# EAGLE design hw4 (EAGLE 9.6.2)
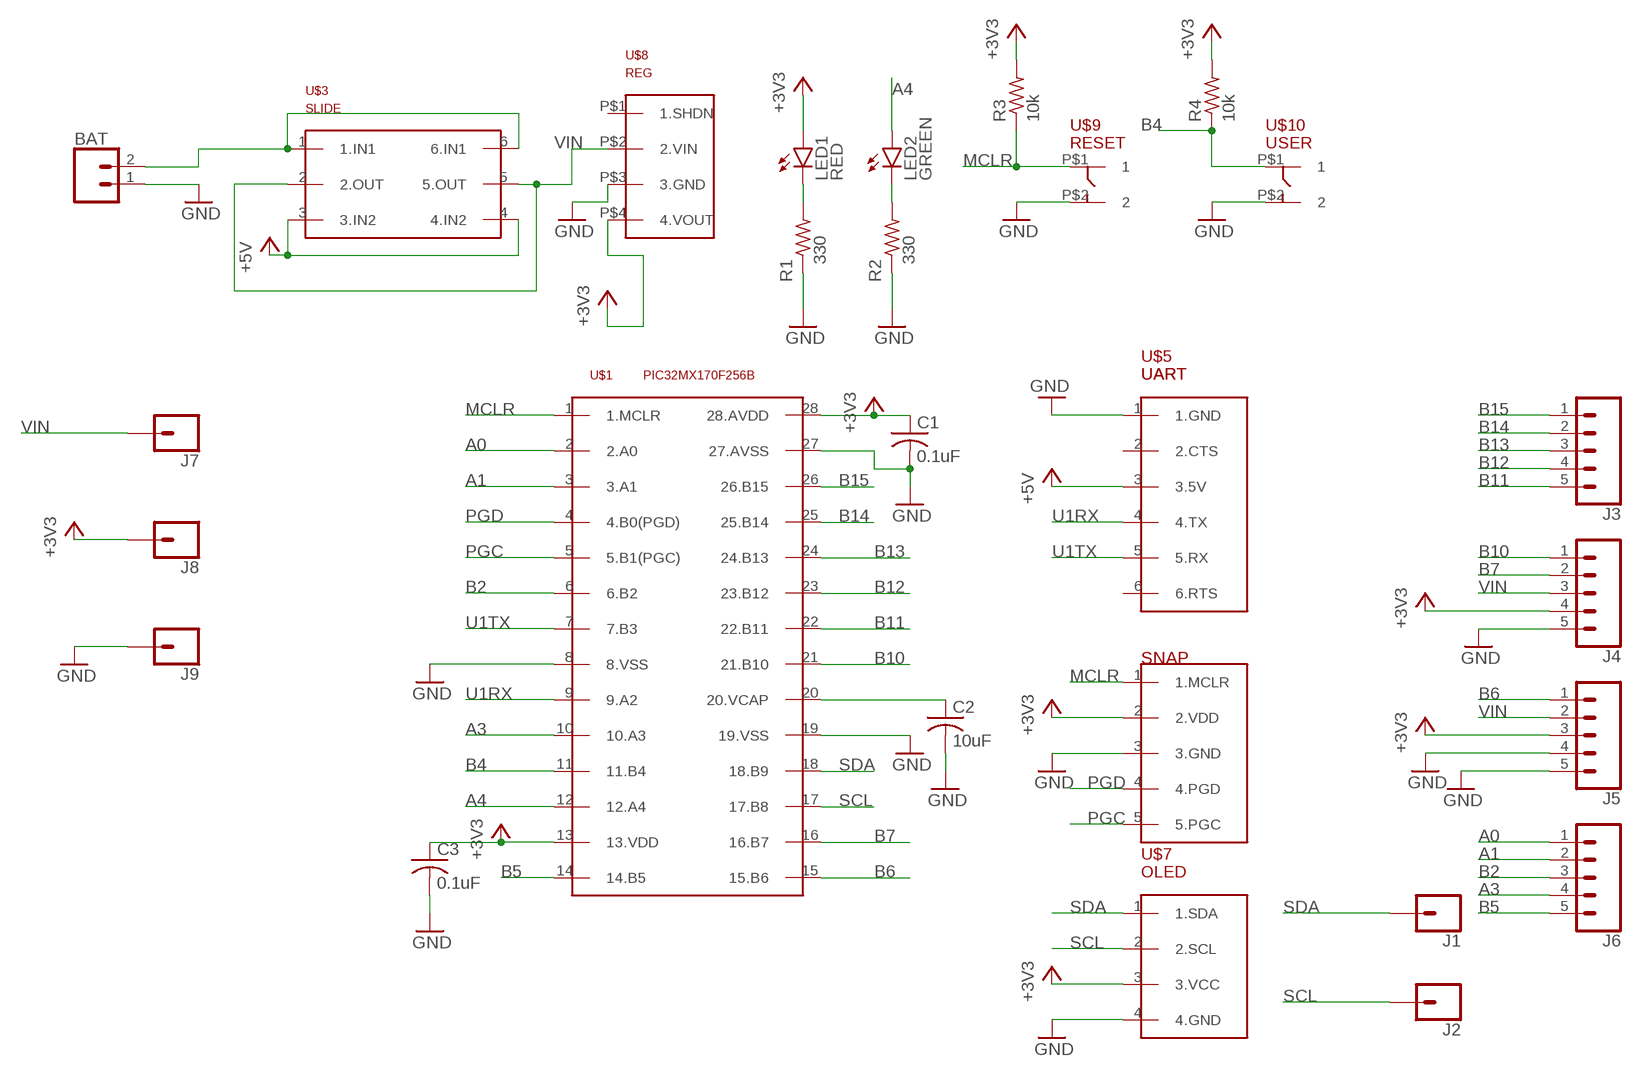
[diagram p0: schematic, sheet 1]

## Parts
BAT  CONN_02  [1X02]
C1  0.1uF  C-US025-024X044  [C025-024X044]
C2  10uF  C-US025-024X044  [C025-024X044]
C3  0.1uF  C-US025-024X044  [C025-024X044]
J1  CONN_01  [1X01]
J2  CONN_01  [1X01]
J3  CONN_05  [1X05]
J4  CONN_05  [1X05]
J5  CONN_05  [1X05]
J6  CONN_05  [1X05]
J7  CONN_01  [1X01]
J8  CONN_01  [1X01]
J9  CONN_01  [1X01]
LED1  RED  LED3MM  [LED3MM]
LED2  GREEN  LED3MM  [LED3MM]
R1  330  R-US_0207/7  [0207/7]
R2  330  R-US_0207/7  [0207/7]
R3  10k  R-US_0207/2V  [0207/2V]
R4  10k  R-US_0207/2V  [0207/2V]
U$1  PIC32MX170F256B  [DIL28-3]
U$3  SLIDE  [SLIDE]
U$5  UART  [UART]
U$6  SNAP  [SNAP]
U$7  OLED  [OLED]
U$8  REG  [REG]
U$9  RESET  PUSH  [PUSH]
U$10  USER  PUSH  [PUSH]

## Nets
+3V3: C1.1 C3.1 J4.4 J5.3 J8.1 LED1.A R3.2 R4.2 U$1.13(13.VDD) U$1.28(28.AVDD) U$6.2(2.VDD) U$7.3(3.VCC) U$8.P$4(4.VOUT)
+5V: U$3.3(3.IN2) U$3.4(4.IN2) U$5.3(3.5V)
A0: J6.1 U$1.2(2.A0)
A1: J6.2 U$1.3(3.A1)
A3: J6.4 U$1.10(10.A3)
A4: LED2.A U$1.12(12.A4)
B2: J6.3 U$1.6(6.B2)
B4: R4.1 U$1.11(11.B4) U$10.P$1
B5: J6.5 U$1.14(14.B5)
B6: J5.1 U$1.15(15.B6)
B7: J4.2 U$1.16(16.B7)
B10: J4.1 U$1.21(21.B10)
B11: J3.5 U$1.22(22.B11)
B12: J3.4 U$1.23(23.B12)
B13: J3.3 U$1.24(24.B13)
B14: J3.2 U$1.25(25.B14)
B15: J3.1 U$1.26(26.B15)
GND: BAT.1 C1.2 C2.2 C3.2 J4.5 J5.4 J5.5 J9.1 R1.1 R2.1 U$1.8(8.VSS) U$1.19(19.VSS) U$1.27(27.AVSS) U$5.1(1.GND) U$6.3(3.GND) U$7.4(4.GND) U$8.P$3(3.GND) U$9.P$2 U$10.P$2
MCLR: R3.1 U$1.1(1.MCLR) U$6.1(1.MCLR) U$9.P$1
N$1: BAT.2 U$3.1(1.IN1) U$3.6(6.IN1)
N$4: C2.1 U$1.20(20.VCAP)
N$5: LED1.K(C) R1.2
N$6: LED2.K(C) R2.2
PGC: U$1.5(5.B1(PGC)) U$6.5(5.PGC)
PGD: U$1.4(4.B0(PGD)) U$6.4(4.PGD)
SCL: J2.1 U$1.17(17.B8) U$7.2(2.SCL)
SDA: J1.1 U$1.18(18.B9) U$7.1(1.SDA)
U1RX: U$1.9(9.A2) U$5.4(4.TX)
U1TX: U$1.7(7.B3) U$5.5(5.RX)
VIN: J4.3 J5.2 J7.1 U$3.2(2.OUT) U$3.5(5.OUT) U$8.P$2(2.VIN)
Unconnected: U$5.2(2.CTS) U$5.6(6.RTS) U$8.P$1(1.SHDN)

## Notes on the sheet
- SNAP

## Library data of the parts
BAT = hw4:CONN_02: Multi connection point. Often used as Generic Header-pin footprint for 0.1 inch spaced/style header connections On any of the 0.1 inch spaced packages, you can populate with these: Break Away Headers - Straight <https://www.sparkfun.com/products/116> (PRT-00116) Break Away Male Headers - Right Angle <https://www.sparkfun.com/products/553> (PRT-00553) Female Headers <https://www.sparkfun.com/products/115> (PRT-00115) Break Away Headers - Machine Pin <https://www.sparkfun.com/products/117> (PRT-00117) Break Away Female Headers - Swiss Machine Pin <https://www.sparkfun.com/products/743> (PRT-00743) For SCREWTERMINALS and SPRING TERMINALS visit here: Screw Terimnals on SparkFun.com <https://www.sparkfun.com/search/results?term=Screw+Terminals> (5mm/3.5mm/2.54mm spacing) This device is also useful as a general connection point to wire up your design to another part of your project. Our various solder wires solder well into these plated through hole pads. Hook-Up Wire - Assortment (Stranded, 22 AWG) <https://www.sparkfun.com/products/11375> (PRT-11375) Hook-Up Wire - Assortment (Solid Core, 22 AWG) <https://www.sparkfun.com/products/11367> (PRT-11367) View the entire wire category on our website here <https://www.sparkfun.com/categories/141> Special notes: Molex polarized connector foot print use with: PRT-08233 with associated crimp pins and housings. 2.54_SCREWTERM for use with PRT-10571. 3.5mm Screw Terminal footprints for PRT-08084 5mm Screw Terminal footprints for use with PRT-08432
C1-C3 = hw4:C-US: CAPACITOR, American symbol; SPICEPREFIX: C
J1 J2 J7-J9 = SparkFun-Connectors:CONN_01: Single connection point. Often used as Generic Header-pin footprint for 0.1 inch spaced/style header connections On any of the 0.1 inch spaced packages, you can populate with these: Break Away Headers - Straight <https://www.sparkfun.com/products/116> (PRT-00116) Break Away Male Headers - Right Angle <https://www.sparkfun.com/products/553> (PRT-00553) Female Headers <https://www.sparkfun.com/products/115> (PRT-00115) Break Away Headers - Machine Pin <https://www.sparkfun.com/products/117> (PRT-00117) Break Away Female Headers - Swiss Machine Pin <https://www.sparkfun.com/products/743> (PRT-00743) This device is also useful as a general connection point to wire up your design to another part of your project. Our various solder wires solder well into these plated through hole pads. Hook-Up Wire - Assortment (Stranded, 22 AWG) <https://www.sparkfun.com/products/11375> (PRT-11375) Hook-Up Wire - Assortment (Solid Core, 22 AWG) <https://www.sparkfun.com/products/11367> (PRT-11367) View the entire wire category on our website here <https://www.sparkfun.com/categories/141> Special notes: SMTSO-256-ET is a "flush mount" nut for a 4-40 screw. We mostly use this on specialty testbeds; it is a nice way to connect hardware to your PCB at an adjustable hieght. Also note, the SNAP packages are for using a snappable style connector. We sell a baggie of snaps and they are also used on two LilyPad designs: Snap Assortment - 30 pack (male and female) <https://www.sparkfun.com/products/11347> (DEV-11347) LilyPad Arduino SimpleSnap <https://www.sparkfun.com/products/10941> (DEV-10941) LilyPad SimpleSnap Protoboard <https://www.sparkfun.com/products/10940> (DEV-10940)
J3-J6 = hw4:CONN_05: Multi connection point. Often used as Generic Header-pin footprint for 0.1 inch spaced/style header connections On any of the 0.1 inch spaced packages, you can populate with these: Break Away Headers - Straight <https://www.sparkfun.com/products/116> (PRT-00116) Break Away Male Headers - Right Angle <https://www.sparkfun.com/products/553> (PRT-00553) Female Headers <https://www.sparkfun.com/products/115> (PRT-00115) Break Away Headers - Machine Pin <https://www.sparkfun.com/products/117> (PRT-00117) Break Away Female Headers - Swiss Machine Pin <https://www.sparkfun.com/products/743> (PRT-00743) For SCREWTERMINALS and SPRING TERMINALS visit here: Screw Terimnals on SparkFun.com <https://www.sparkfun.com/search/results?term=Screw+Terminals> (5mm/3.5mm/2.54mm spacing) This device is also useful as a general connection point to wire up your design to another part of your project. Our various solder wires solder well into these plated through hole pads. Hook-Up Wire - Assortment (Stranded, 22 AWG) <https://www.sparkfun.com/products/11375> (PRT-11375) Hook-Up Wire - Assortment (Solid Core, 22 AWG) <https://www.sparkfun.com/products/11367> (PRT-11367) View the entire wire category on our website here <https://www.sparkfun.com/categories/141> Special notes: Molex polarized connector foot print use with SKU : PRT-08231 with associated crimp pins and housings. 1MM SMD Version SKU: PRT-10208
LED1 LED2 = hw4:LED: LED OSRAM: - CHIPLED LG R971, LG N971, LY N971, LG Q971, LY Q971, LO R971, LY R971 LH N974, LH R974 LS Q976, LO Q976, LY Q976 LO Q996 - Hyper CHIPLED LW Q18S LB Q993, LB Q99A, LB R99A - SideLED LS A670, LO A670, LY A670, LG A670, LP A670 LB A673, LV A673, LT A673, LW A673 LH A674 LY A675 LS A676, LA A676, LO A676, LY A676, LW A676 LS A679, LY A679, LG A679 - Hyper Micro SIDELED® LS Y876, LA Y876, LO Y876, LY Y876 LT Y87S - SmartLED LW L88C, LW L88S LB L89C, LB L89S, LG L890 LS L89K, LO L89K, LY L89K LS L896, LA L896, LO L896, LY L896 - TOPLED LS T670, LO T670, LY T670, LG T670, LP T670 LSG T670, LSP T670, LSY T670, LOP T670, LYG T670 LG T671, LOG T671, LSG T671 LB T673, LV T673, LT T673, LW T673 LH T674 LS T676, LA T676, LO T676, LY T676, LB T676, LH T676, LSB T676, LW T676 LB T67C, LV T67C, LT T67C, LS T67K, LO T67K, LY T67K, LW E67C LS E67B, LA E67B, LO E67B, LY E67B, LB E67C, LV E67C, LT E67C LW T67C LS T679, LY T679, LG T679 LS T770, LO T770, LY T770, LG T770, LP T770 LB T773, LV T773, LT T773, LW T773 LH T774 LS E675, LA E675, LY E675, LS T675 LS T776, LA T776, LO T776, LY T776, LB T776 LHGB T686 LT T68C, LB T68C - Hyper Mini TOPLED® LB M676 - Mini TOPLED Santana® LG M470 LS M47K, LO M47K, LY M47K Source: http://www.osram.convergy.de LUXEON: - LUMILED® LXK2-PW12-R00, LXK2-PW12-S00, LXK2-PW14-U00, LXK2-PW14-V00 LXK2-PM12-R00, LXK2-PM12-S00, LXK2-PM14-U00 LXK2-PE12-Q00, LXK2-PE12-R00, LXK2-PE12-S00, LXK2-PE14-T00, LXK2-PE14-U00 LXK2-PB12-K00, LXK2-PB12-L00, LXK2-PB12-M00, LXK2-PB14-N00, LXK2-PB14-P00, LXK2-PB14-Q00 LXK2-PR12-L00, LXK2-PR12-M00, LXK2-PR14-Q00, LXK2-PR14-R00 LXK2-PD12-Q00, LXK2-PD12-R00, LXK2-PD12-S00 LXK2-PH12-R00, LXK2-PH12-S00 LXK2-PL12-P00, LXK2-PL12-Q00, LXK2-PL12-R00 Source: www.luxeon.com KINGBRIGHT: KA-3528ASYC Source: www.kingbright.com
R1-R4 = hw4:R-US_: RESISTOR, American symbol; SPICEPREFIX: R
U$1 = hw4:PIC32MX170F256B
U$3 = hw4:SLIDE
U$5 = hw4:UART
U$6 = hw4:SNAP
U$7 = hw4:OLED
U$8 = hw4:REG
U$9 U$10 = hw4:PUSH

## Board
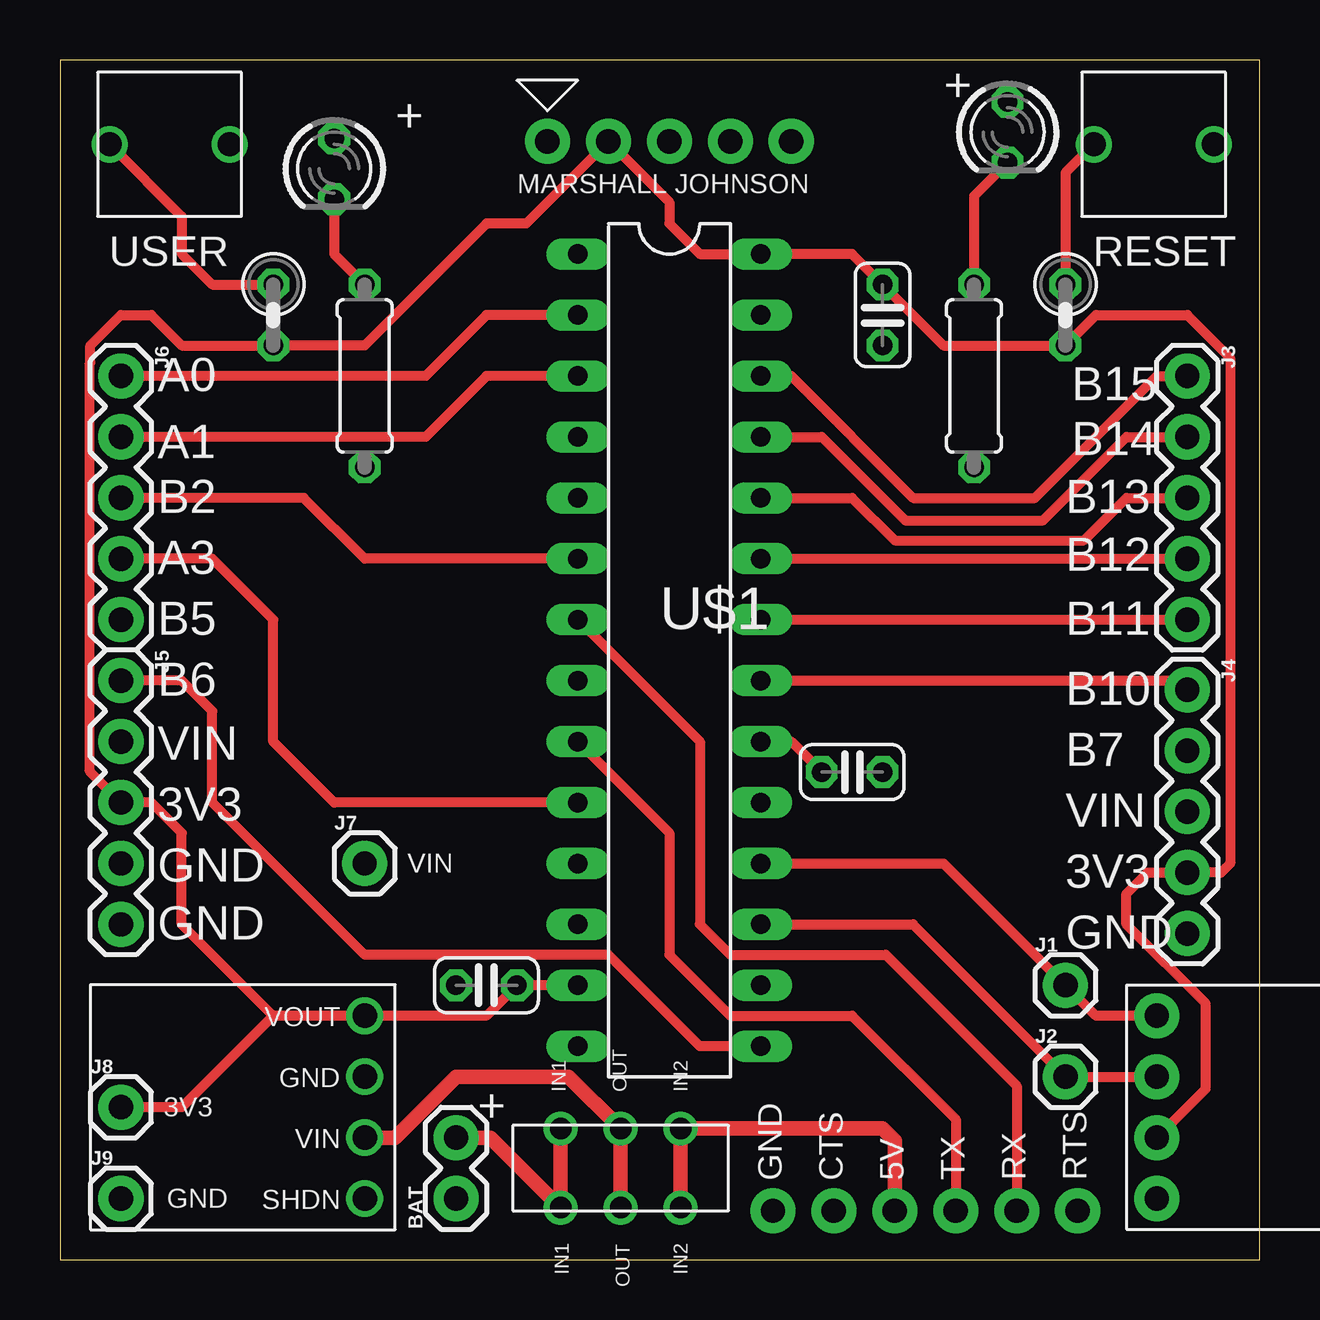
[diagram p1: board, top side]
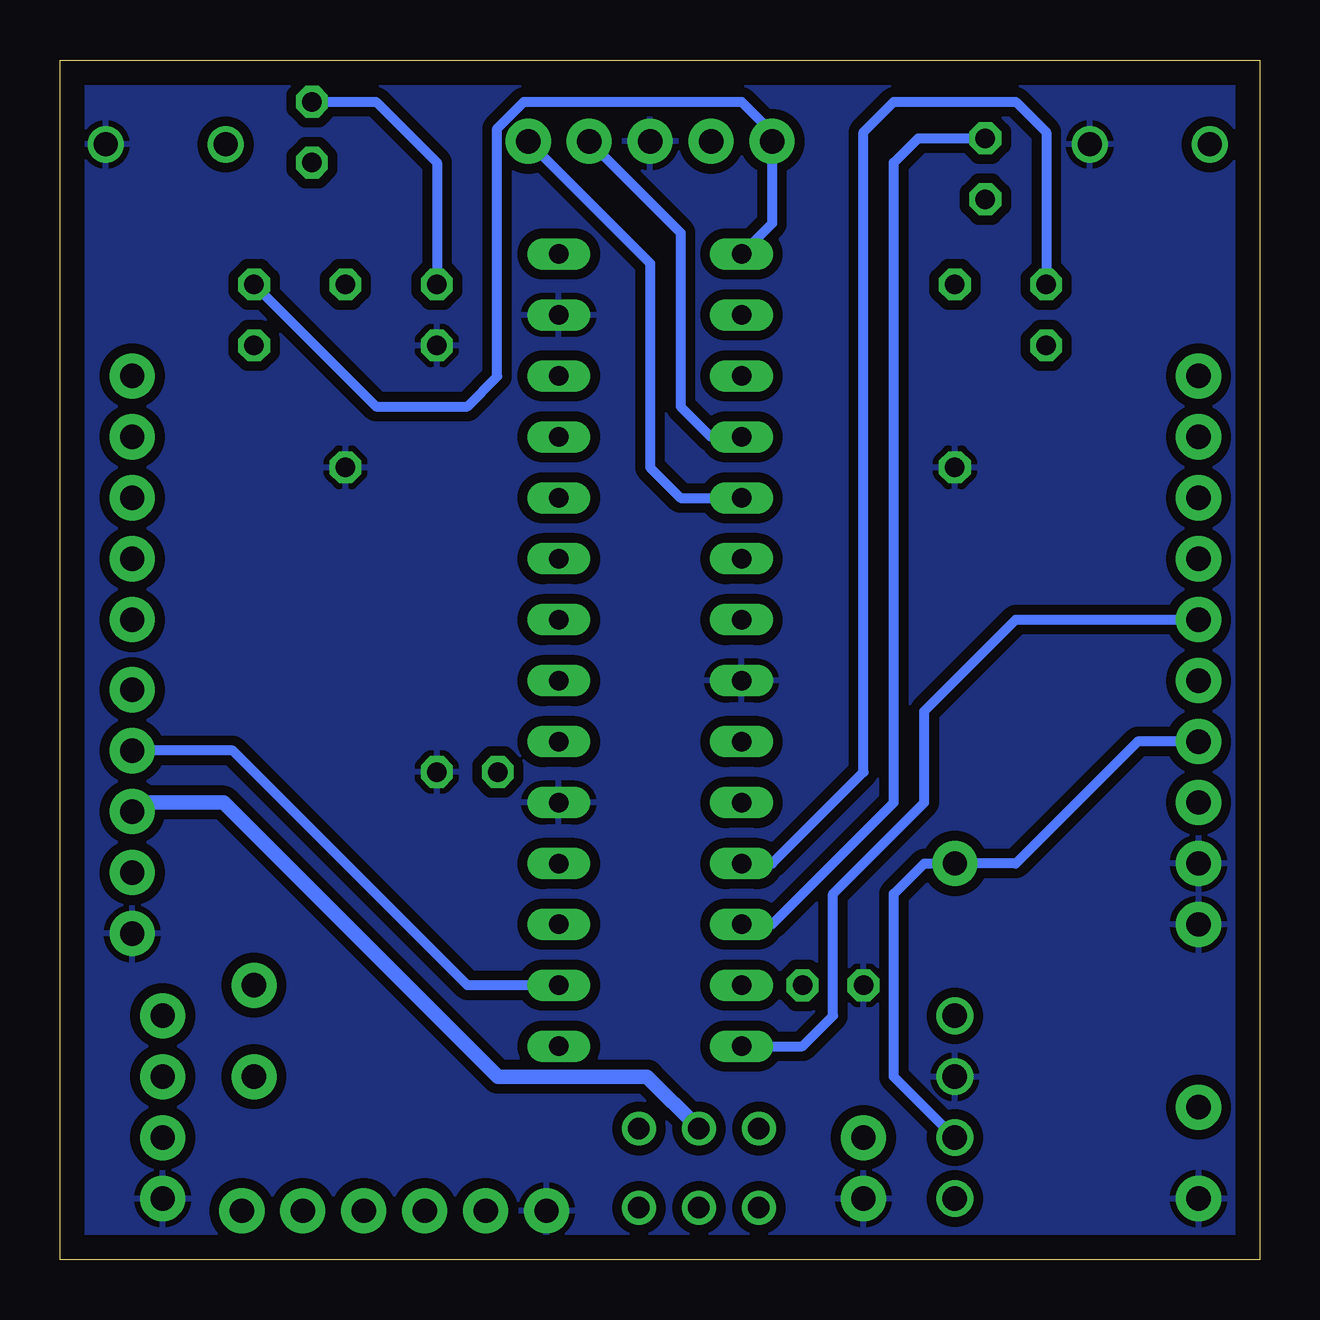
[diagram p2: board, bottom side, seen from below]

Size 50 x 50 mm. Coordinates in mm from the lower left corner, seen from the top.
Outline: 0,0 50,0 50,50 0,50 0,0
Copper layers (1*16): Top 0.035mm / dielectric 1.5mm / Bottom 0.035mm
Design rules "default": minimum track width 6mil, minimum drill 0.35mm, track to track 6mil, track to pad 6mil, pad to pad 6mil, via to via 6mil, smd to smd 6mil, copper to edge 40mil, drill to drill 6mil, minimum pad ring 10mil, minimum via ring 8mil, stop-mask expansion 4mil, vias tented up to drill 0mil, thermal gap 10mil

### Footprints (pad centres in the part's own frame; a part is rotated, then mirrored left to right if it is on the bottom)
1X02 = drill 1.016 pad 1.88: 1 0,0; 2 2.54,0
C025-024X044 = drill 0.813 octagon: 1 -1.27,0; 2 1.27,0
1X01 = drill 1.016 pad 1.88: 1 0,0
1X05 = drill 1.016 pad 1.88: 1 0,0; 2 2.54,0; 3 5.08,0; 4 7.62,0; 5 10.16,0
LED3MM = drill 0.813 octagon: A -1.27,0; K 1.27,0
0207/7 = drill 0.813 octagon: 1 -3.81,0; 2 3.81,0
0207/2V = drill 0.813 octagon: 1 -1.27,0; 2 1.27,0
DIL28-3 = drill 0.813 long: 1 -16.51,-3.81; 2 -13.97,-3.81; 3 -11.43,-3.81; 4 -8.89,-3.81; 5 -6.35,-3.81; 6 -3.81,-3.81; 7 -1.27,-3.81; 8 1.27,-3.81; 9 3.81,-3.81; 10 6.35,-3.81; 11 8.89,-3.81; 12 11.43,-3.81; 13 13.97,-3.81; 14 16.51,-3.81; 15 16.51,3.81; 16 13.97,3.81; 17 11.43,3.81; 18 8.89,3.81; 19 6.35,3.81; 20 3.81,3.81; 21 1.27,3.81; 22 -1.27,3.81; 23 -3.81,3.81; 24 -6.35,3.81; 25 -8.89,3.81; 26 -11.43,3.81; 27 -13.97,3.81; 28 -16.51,3.81
SLIDE = drill 0.9: 1 -1.65,2.5; 2 -1.65,0; 3 -1.65,-2.5; 4 1.65,-2.5; 5 1.65,0; 6 1.65,2.5
UART = drill 1.016 pad 1.88: 1 0,6.35; 2 0,3.81; 3 0,1.27; 4 0,-1.27; 5 0,-3.81; 6 0,-6.35
SNAP = drill 1.016 pad 1.88: 1 -5.08,0; 2 -2.54,0; 3 0,0; 4 2.54,0; 5 5.08,0
OLED = drill 1.016 pad 1.88: 1 -6.35,3.81; 2 -6.35,1.27; 3 -6.35,-1.27; 4 -6.35,-3.81
REG = drill 1.02: P$1 -5.08,3.81; P$2 -5.08,1.27; P$3 -5.08,-1.27; P$4 -5.08,-3.81
PUSH = drill 1: P$1 -2.5,0; P$2 2.5,0

### Placement (x,y rotation side)
BAT  16.51,2.54 90 top
C1  34.29,39.37 270 top
C2  33.02,20.32 0 top
C3  17.78,11.43 180 top
J1  41.91,11.43 0 top
J2  41.91,7.62 0 top
J3  46.99,36.83 270 top
J4  46.99,23.75 270 top
J5  2.54,24.13 270 top
J6  2.54,36.83 270 top
J7  12.7,16.51 0 top
J8  2.54,6.35 0 top
J9  2.54,2.54 0 top
LED1  39.5,46.99 270 top
LED2  11.43,45.47 270 top
R1  38.1,36.83 90 top
R2  12.7,36.83 90 top
R3  41.91,39.37 270 top
R4  8.89,39.37 270 top
U$1  25.4,25.4 270 top
U$3  23.37,3.81 90 top
U$5  36.07,2.03 90 top
U$6  25.4,46.61 0 top
U$7  52.07,6.35 0 top
U$8  7.62,6.35 180 top
U$9  45.59,46.48 0 top
U$10  4.57,46.48 0 top

### Tracks (layer width: path | path; a pad name or v marks a point on that pad's centre or on a via)
+3V3
  Top 0.406: U$7.3 47.75,7.11 47.75,10.67 44.45,13.97 44.45,15.24 45.34,16.13 J4.4 48.4,16.13 48.78,16.51 48.78,37.58 46.99,39.37 43.18,39.37 R3.2 36.83,38.1 C1.1 33.02,41.91 U$1.28 26.67,41.91 25.4,43.18 25.4,44.07 U$6.2 19.43,43.18 17.78,43.18 12.7,38.1 R4.2 5.08,38.1 3.81,39.37 2.54,39.37 1.27,38.1 1.27,37.39 1.25,37.37 1.25,20.34 J5.3 3.81,19.05 5.08,17.78 5.08,13.97 8.89,10.16 | 8.89,10.16 U$8.P$4 17.78,10.16 C3.1 U$1.13 | 8.89,10.16 5.08,6.35 J8.1
  Bottom 0.406: LED1.A 36.83,48.26 34.29,45.72 C1.1
+5V
  Top 0.61: U$3.3 U$3.4 34.29,5.46 34.8,4.95 U$5.3
A0
  Top 0.406: U$1.2 17.78,39.37 15.24,36.83 J6.1
A1
  Top 0.406: U$1.3 17.78,36.83 15.24,34.29 J6.2
A3
  Top 0.406: U$1.10 11.43,19.05 8.89,21.59 8.89,26.67 6.35,29.21 J6.4
A4
  Bottom 0.406: U$1.12 20.32,13.97 15.24,19.05 15.24,45.72 14.22,46.74 LED2.A
B2
  Top 0.406: U$1.6 12.7,29.21 10.16,31.75 J6.3
B4
  Top 0.406: U$10.P$1 5.08,43.47 5.08,41.91 6.35,40.64 R4.1
  Bottom 0.406: U$1.11 20.32,16.51 16.51,20.32 16.51,46.99 15.24,48.26 10.16,48.26 8.89,46.99 R4.1
B5
  Bottom 0.406: U$1.14 19.05,8.89 17.78,10.16 17.78,15.24 13.97,19.05 13.97,22.86 10.16,26.67 J6.5
B6
  Top 0.406: U$1.15 26.67,8.89 22.86,12.7 12.7,12.7 6.35,19.05 6.35,22.86 5.08,24.13 J5.1
B7
  Bottom 0.406: U$1.16 33.02,11.43 42.8,21.21 J4.2
B10
  Top 0.406: U$1.21 46.61,24.13 J4.1
B11
  Top 0.406: U$1.22 J3.5
B12
  Top 0.406: U$1.23 J3.4
B13
  Top 0.406: U$1.24 33.02,31.75 34.8,29.97 42.67,29.97 44.45,31.75 J3.3
B14
  Top 0.406: U$1.25 31.75,34.29 35.23,30.81 40.97,30.81 44.45,34.29 J3.2
B15
  Top 0.406: U$1.26 30.48,36.83 35.56,31.75 40.64,31.75 45.72,36.83 J3.1
GND
  pour Bottom (isolate 0.406): 0,0 50.8,0 50.8,50.8 0,50.8
MCLR
  Top 0.406: U$9.P$1 41.91,45.3 R3.1
  Bottom 0.406: U$1.1 20.32,43.18 U$6.1 20.32,46.99 21.59,48.26 30.66,48.26 31.77,47.15 31.77,36.8 33.02,35.56 36.83,35.56 R3.1
N$1
  Top 0.61: U$3.6 U$3.1 17.95,5.08 BAT.2
N$4
  Top 0.406: U$1.20 30.48,21.59 C2.1
N$5
  Top 0.406: LED1.K 38.1,44.32 R1.2
N$6
  Top 0.406: LED2.K 11.43,41.91 R2.2
PGC
  Bottom 0.406: U$6.5 25.4,41.53 25.4,33.02 24.13,31.75 U$1.5
PGD
  Bottom 0.406: U$6.4 24.13,42.8 24.13,35.56 22.86,34.29 U$1.4
SCL
  Top 0.406: U$1.17 35.56,13.97 J2.1 U$7.2
SDA
  Top 0.406: U$1.18 36.83,16.51 J1.1 43.18,10.16 U$7.1
U1RX
  Top 0.406: U$1.9 25.4,17.78 25.4,12.7 27.94,10.16 33.02,10.16 37.34,5.84 U$5.4
U1TX
  Top 0.406: U$1.7 26.67,21.59 26.67,13.97 27.94,12.7 34.42,12.7 39.88,7.24 U$5.5
VIN
  Top 0.61: U$3.2 U$3.5 21.21,7.62 16.51,7.62 13.97,5.08 U$8.P$2
  Bottom 0.406: U$8.P$2 15.24,7.62 15.24,15.24 13.97,16.51 J7.1 10.16,16.51 5.08,21.59 J5.2
  Bottom 0.61: U$3.5 25.53,7.62 31.75,7.62 43.18,19.05 46.61,19.05 J4.3

### Text on the board
tPlace: + | + | MARSHALL JOHNSON | A0 | B15 | B14 | A1 | B2 | B13 | A3 | B12 | B5 | B11 | B6 | B10 | VIN | B7 | 3V3 | VIN | GND | VIN | 3V3 | GND | GND | 3V3 | + | GND
200bmp: /home/mpjohns/Downloads/green-bay-packers-logo (1).bmp